# Altium schematic sheet main.SchDoc
size A3
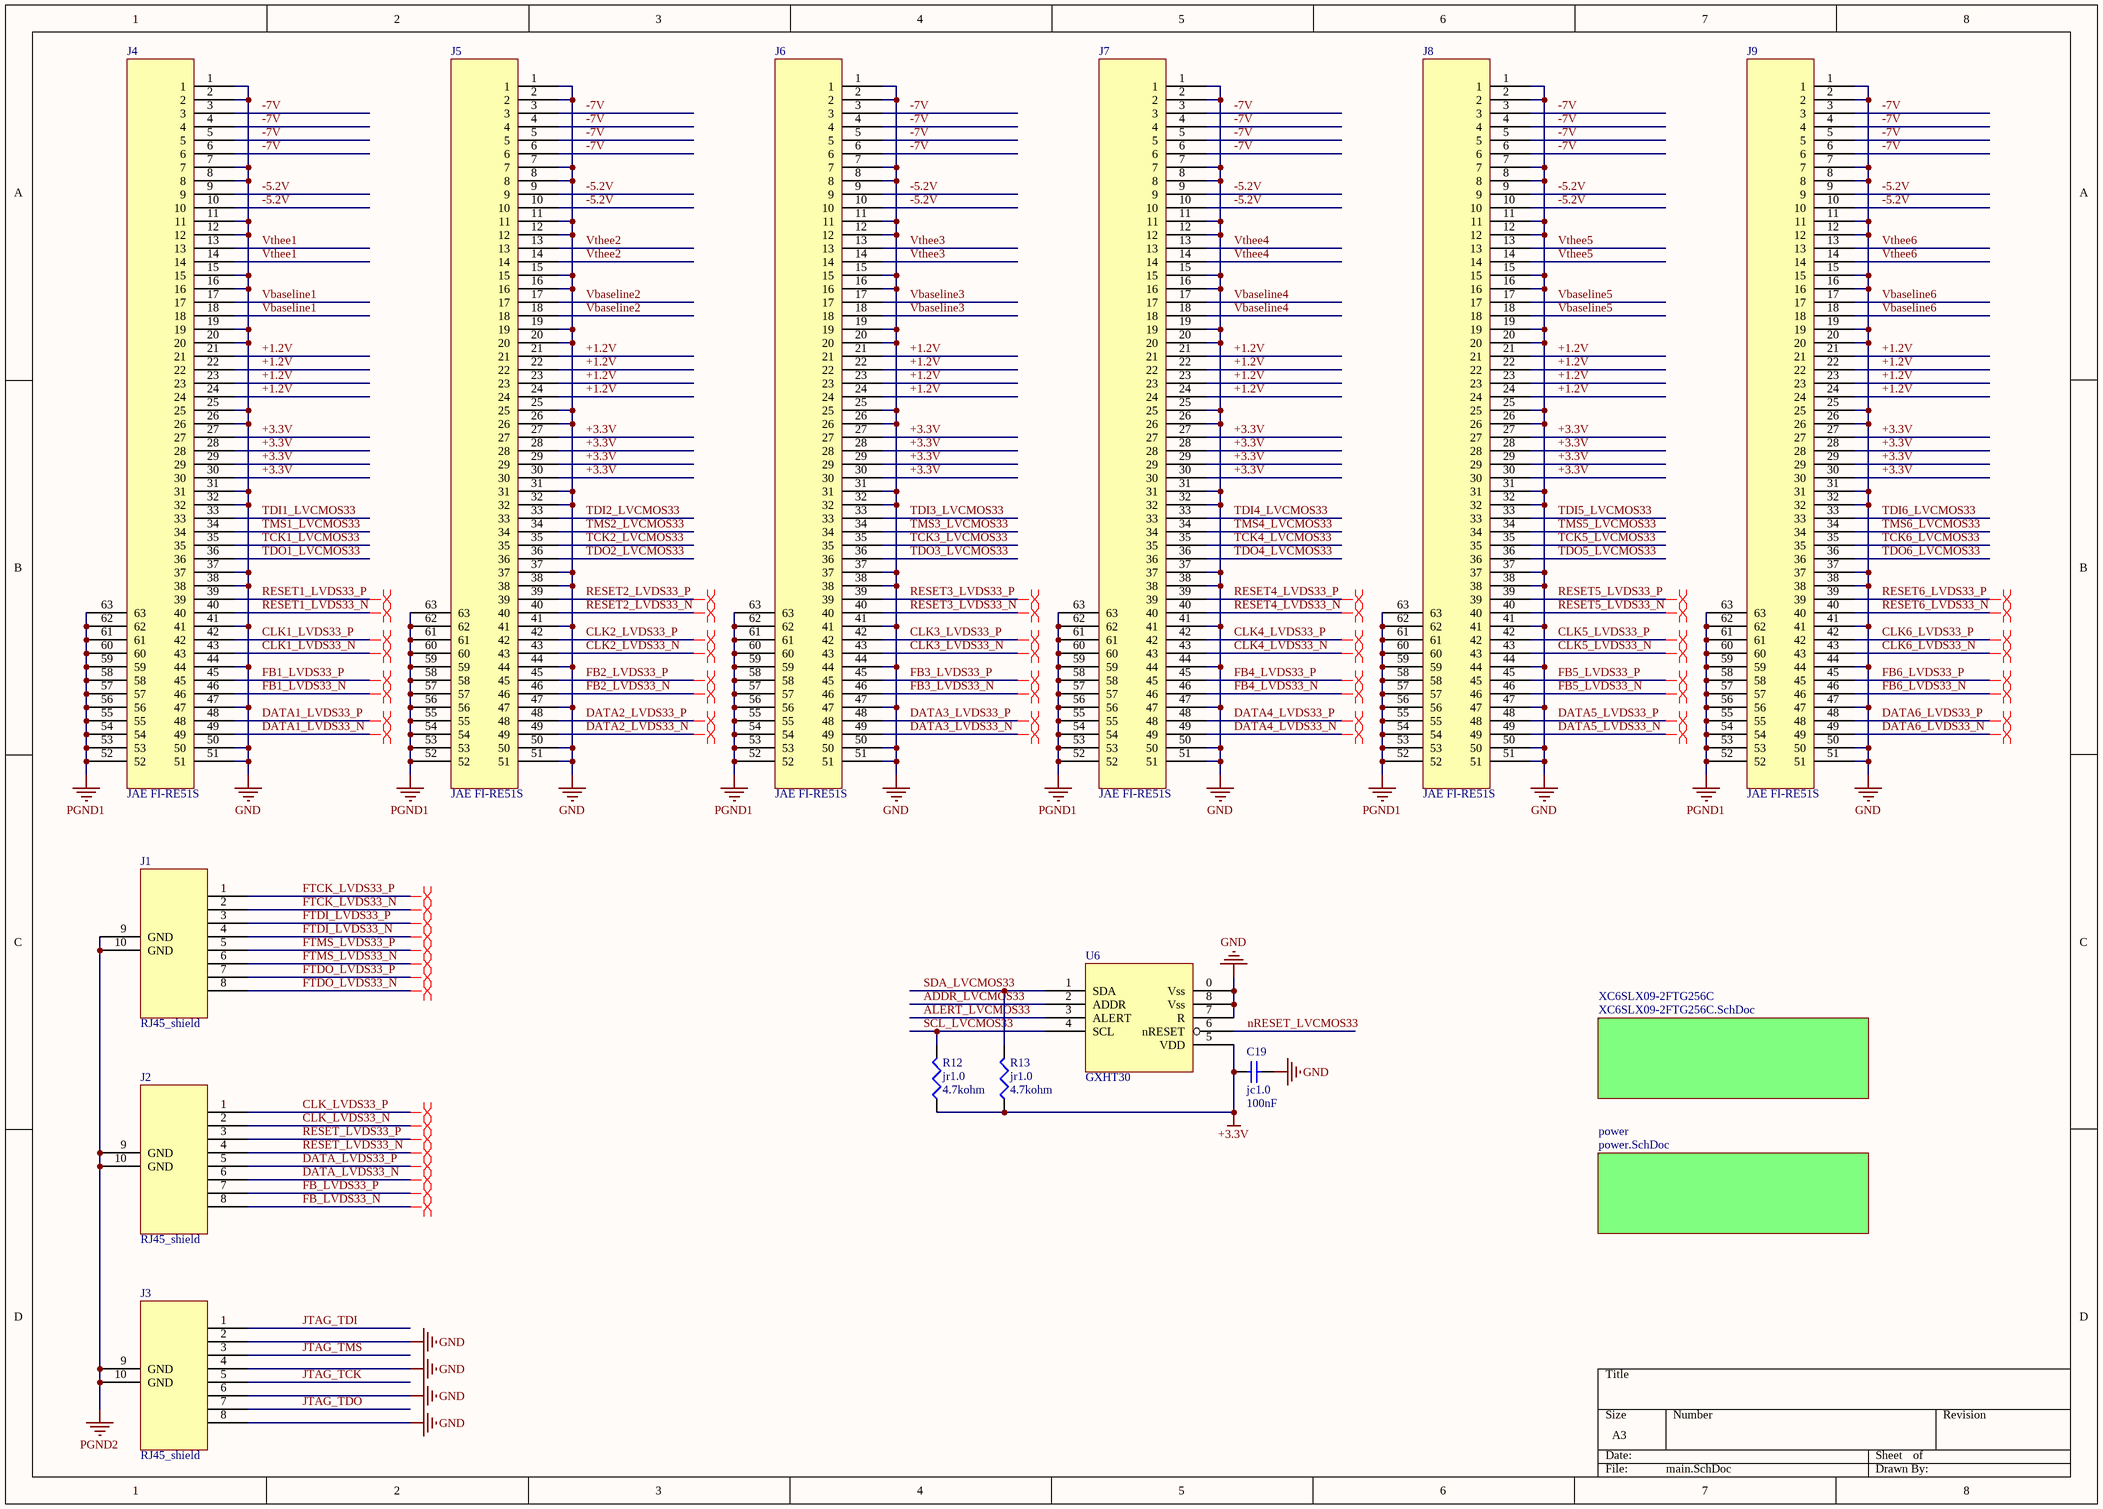
[diagram p0: main.SchDoc]

## Parts
C19  jc1.0  value 100nF  [0402]
J1  RJ45_shield  [RJ45_shield]
J2  RJ45_shield  [RJ45_shield]
J3  RJ45_shield  [RJ45_shield]
J4  JAE FI-RE51S  [FI-RE51S-VF]
J5  JAE FI-RE51S  [FI-RE51S-VF]
J6  JAE FI-RE51S  [FI-RE51S-VF]
J7  JAE FI-RE51S  [FI-RE51S-VF]
J8  JAE FI-RE51S  [FI-RE51S-VF]
J9  JAE FI-RE51S  [FI-RE51S-VF]
R12  jr1.0  value 4.7kohm  [0402]
R13  jr1.0  value 4.7kohm  [0402]
U6  GXHT30  [GXHT30]

## Sub-sheets
power = power.SchDoc: no entries
XC6SLX09-2FTG256C = XC6SLX09-2FTG256C.SchDoc: no entries

## Nets
+3.3V: C19.1 J4.27 J4.28 J4.29 J4.30 J5.27 J5.28 J5.29 J5.30 J6.27 J6.28 J6.29 J6.30 J7.27 J7.28 J7.29 J7.30 J8.27 J8.28 J8.29 J8.30 J9.27 J9.28 J9.29 J9.30 R12.1 R13.1 U6.5(VDD)
GND: C19.2 J3.2 J3.4 J3.6 J3.8 J4.1 J4.2 J4.7 J4.8 J4.11 J4.12 J4.15 J4.16 J4.19 J4.20 J4.25 J4.26 J4.31 J4.32 J4.37 J4.38 J4.41 J4.44 J4.47 J4.50 J4.51 J5.1 J5.2 J5.7 J5.8 J5.11 J5.12 J5.15 J5.16 J5.19 J5.20 J5.25 J5.26 J5.31 J5.32 J5.37 J5.38 J5.41 J5.44 J5.47 J5.50 J5.51 J6.1 J6.2 J6.7 J6.8 J6.11 J6.12 J6.15 J6.16 J6.19 J6.20 J6.25 J6.26 J6.31 J6.32 J6.37 J6.38 J6.41 J6.44 J6.47 J6.50 J6.51 J7.1 J7.2 J7.7 J7.8 J7.11 J7.12 J7.15 J7.16 J7.19 J7.20 J7.25 J7.26 J7.31 J7.32 J7.37 J7.38 J7.41 J7.44 J7.47 J7.50 J7.51 J8.1 J8.2 J8.7 J8.8 J8.11 J8.12 J8.15 J8.16 J8.19 J8.20 J8.25 J8.26 J8.31 J8.32 J8.37 J8.38 J8.41 J8.44 J8.47 J8.50 J8.51 J9.1 J9.2 J9.7 J9.8 J9.11 J9.12 J9.15 J9.16 J9.19 J9.20 J9.25 J9.26 J9.31 J9.32 J9.37 J9.38 J9.41 J9.44 J9.47 J9.50 J9.51 U6.0(Vss) U6.7(R) U6.8(Vss)
PGND1: J4.52 J4.53 J4.54 J4.55 J4.56 J4.57 J4.58 J4.59 J4.60 J4.61 J4.62 J4.63 J5.52 J5.53 J5.54 J5.55 J5.56 J5.57 J5.58 J5.59 J5.60 J5.61 J5.62 J5.63 J6.52 J6.53 J6.54 J6.55 J6.56 J6.57 J6.58 J6.59 J6.60 J6.61 J6.62 J6.63 J7.52 J7.53 J7.54 J7.55 J7.56 J7.57 J7.58 J7.59 J7.60 J7.61 J7.62 J7.63 J8.52 J8.53 J8.54 J8.55 J8.56 J8.57 J8.58 J8.59 J8.60 J8.61 J8.62 J8.63 J9.52 J9.53 J9.54 J9.55 J9.56 J9.57 J9.58 J9.59 J9.60 J9.61 J9.62 J9.63
PGND2: J1.9(GND) J1.10(GND) J2.9(GND) J2.10(GND) J3.9(GND) J3.10(GND)
+1.2V: J4.21 J4.22 J4.23 J4.24 J5.21 J5.22 J5.23 J5.24 J6.21 J6.22 J6.23 J6.24 J7.21 J7.22 J7.23 J7.24 J8.21 J8.22 J8.23 J8.24 J9.21 J9.22 J9.23 J9.24
-5.2V: J4.9 J4.10 J5.9 J5.10 J6.9 J6.10 J7.9 J7.10 J8.9 J8.10 J9.9 J9.10
-7V: J4.3 J4.4 J4.5 J4.6 J5.3 J5.4 J5.5 J5.6 J6.3 J6.4 J6.5 J6.6 J7.3 J7.4 J7.5 J7.6 J8.3 J8.4 J8.5 J8.6 J9.3 J9.4 J9.5 J9.6
ADDR_LVCMOS33: U6.2(ADDR)
ALERT_LVCMOS33: U6.3(ALERT)
CLK1_LVDS33_N: J4.43
CLK1_LVDS33_P: J4.42
CLK2_LVDS33_N: J5.43
CLK2_LVDS33_P: J5.42
CLK3_LVDS33_N: J6.43
CLK3_LVDS33_P: J6.42
CLK4_LVDS33_N: J7.43
CLK4_LVDS33_P: J7.42
CLK5_LVDS33_N: J8.43
CLK5_LVDS33_P: J8.42
CLK6_LVDS33_N: J9.43
CLK6_LVDS33_P: J9.42
CLK_LVDS33_N: J2.2
CLK_LVDS33_P: J2.1
DATA1_LVDS33_N: J4.49
DATA1_LVDS33_P: J4.48
DATA2_LVDS33_N: J5.49
DATA2_LVDS33_P: J5.48
DATA3_LVDS33_N: J6.49
DATA3_LVDS33_P: J6.48
DATA4_LVDS33_N: J7.49
DATA4_LVDS33_P: J7.48
DATA5_LVDS33_N: J8.49
DATA5_LVDS33_P: J8.48
DATA6_LVDS33_N: J9.49
DATA6_LVDS33_P: J9.48
DATA_LVDS33_N: J2.6
DATA_LVDS33_P: J2.5
FB1_LVDS33_N: J4.46
FB1_LVDS33_P: J4.45
FB2_LVDS33_N: J5.46
FB2_LVDS33_P: J5.45
FB3_LVDS33_N: J6.46
FB3_LVDS33_P: J6.45
FB4_LVDS33_N: J7.46
FB4_LVDS33_P: J7.45
FB5_LVDS33_N: J8.46
FB5_LVDS33_P: J8.45
FB6_LVDS33_N: J9.46
FB6_LVDS33_P: J9.45
FB_LVDS33_N: J2.8
FB_LVDS33_P: J2.7
FTCK_LVDS33_N: J1.2
FTCK_LVDS33_P: J1.1
FTDI_LVDS33_N: J1.4
FTDI_LVDS33_P: J1.3
FTDO_LVDS33_N: J1.8
FTDO_LVDS33_P: J1.7
FTMS_LVDS33_N: J1.6
FTMS_LVDS33_P: J1.5
JTAG_TCK: J3.5
JTAG_TDI: J3.1
JTAG_TDO: J3.7
JTAG_TMS: J3.3
nRESET_LVCMOS33: U6.6(nRESET)
RESET1_LVDS33_N: J4.40
RESET1_LVDS33_P: J4.39
RESET2_LVDS33_N: J5.40
RESET2_LVDS33_P: J5.39
RESET3_LVDS33_N: J6.40
RESET3_LVDS33_P: J6.39
RESET4_LVDS33_N: J7.40
RESET4_LVDS33_P: J7.39
RESET5_LVDS33_N: J8.40
RESET5_LVDS33_P: J8.39
RESET6_LVDS33_N: J9.40
RESET6_LVDS33_P: J9.39
RESET_LVDS33_N: J2.4
RESET_LVDS33_P: J2.3
SCL_LVCMOS33: R12.2 U6.4(SCL)
SDA_LVCMOS33: R13.2 U6.1(SDA)
TCK1_LVCMOS33: J4.35
TCK2_LVCMOS33: J5.35
TCK3_LVCMOS33: J6.35
TCK4_LVCMOS33: J7.35
TCK5_LVCMOS33: J8.35
TCK6_LVCMOS33: J9.35
TDI1_LVCMOS33: J4.33
TDI2_LVCMOS33: J5.33
TDI3_LVCMOS33: J6.33
TDI4_LVCMOS33: J7.33
TDI5_LVCMOS33: J8.33
TDI6_LVCMOS33: J9.33
TDO1_LVCMOS33: J4.36
TDO2_LVCMOS33: J5.36
TDO3_LVCMOS33: J6.36
TDO4_LVCMOS33: J7.36
TDO5_LVCMOS33: J8.36
TDO6_LVCMOS33: J9.36
TMS1_LVCMOS33: J4.34
TMS2_LVCMOS33: J5.34
TMS3_LVCMOS33: J6.34
TMS4_LVCMOS33: J7.34
TMS5_LVCMOS33: J8.34
TMS6_LVCMOS33: J9.34
Vbaseline1: J4.17 J4.18
Vbaseline2: J5.17 J5.18
Vbaseline3: J6.17 J6.18
Vbaseline4: J7.17 J7.18
Vbaseline5: J8.17 J8.18
Vbaseline6: J9.17 J9.18
Vthee1: J4.13 J4.14
Vthee2: J5.13 J5.14
Vthee3: J6.13 J6.14
Vthee4: J7.13 J7.14
Vthee5: J8.13 J8.14
Vthee6: J9.13 J9.14

## Layout directives
differential pair: CLK1_LVDS33_N, CLK1_LVDS33_P, CLK2_LVDS33_N, CLK2_LVDS33_P, CLK3_LVDS33_N, CLK3_LVDS33_P, CLK4_LVDS33_N, CLK4_LVDS33_P, CLK5_LVDS33_N, CLK5_LVDS33_P, CLK6_LVDS33_N, CLK6_LVDS33_P, CLK_LVDS33_N, CLK_LVDS33_P, DATA1_LVDS33_N, DATA1_LVDS33_P, DATA2_LVDS33_N, DATA2_LVDS33_P, DATA3_LVDS33_N, DATA3_LVDS33_P, DATA4_LVDS33_N, DATA4_LVDS33_P, DATA5_LVDS33_N, DATA5_LVDS33_P, DATA6_LVDS33_N, DATA6_LVDS33_P, DATA_LVDS33_N, DATA_LVDS33_P, FB1_LVDS33_N, FB1_LVDS33_P, FB2_LVDS33_N, FB2_LVDS33_P, FB3_LVDS33_N, FB3_LVDS33_P, FB4_LVDS33_N, FB4_LVDS33_P, FB5_LVDS33_N, FB5_LVDS33_P, FB6_LVDS33_N, FB6_LVDS33_P, FB_LVDS33_N, FB_LVDS33_P, FTCK_LVDS33_N, FTCK_LVDS33_P, FTDI_LVDS33_N, FTDI_LVDS33_P, FTDO_LVDS33_N, FTDO_LVDS33_P, FTMS_LVDS33_N, FTMS_LVDS33_P, RESET1_LVDS33_N, RESET1_LVDS33_P, RESET2_LVDS33_N, RESET2_LVDS33_P, RESET3_LVDS33_N, RESET3_LVDS33_P, RESET4_LVDS33_N, RESET4_LVDS33_P, RESET5_LVDS33_N, RESET5_LVDS33_P, RESET6_LVDS33_N, RESET6_LVDS33_P, RESET_LVDS33_N, RESET_LVDS33_P

## Library data of the parts
C19 = Cap: Capacitor; Published: 8-Jun-2000; LatestRevisionDate: 17-Jul-2002; LatestRevisionNote: Re-released for DXP Platform.; PackageReference: RAD-0.3; Publisher: Altium Limited
R12 R13 = Res: Resistor; Published: 8-Jun-2000; LatestRevisionDate: 04-Mar-2005; LatestRevisionNote: PCB Footprint replaced.; PackageReference: J1-0603; Publisher: Altium Limited